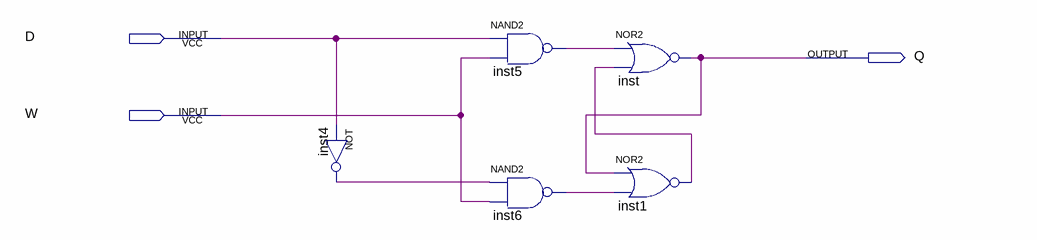
[diagram p0: schematic sheet]
// Quartus schematic Dlatchtest.bdf as structural Verilog: 5 symbols, 3 pins
module Dlatchtest (
  input  D,
  input  W,
  output Q
);

  wire inst1_out, inst4_out, inst5_out, inst6_out;

  not inst4 (inst4_out, D);
  nand inst5 (inst5_out, D, W);
  nand inst6 (inst6_out, inst4_out, W);
  nor inst (Q, inst5_out, inst1_out);
  nor inst1 (inst1_out, Q, inst6_out);
endmodule
